# Altium schematic sheet STM32F103RCT6_V2.1.schdoc
size 279 x 241 mm
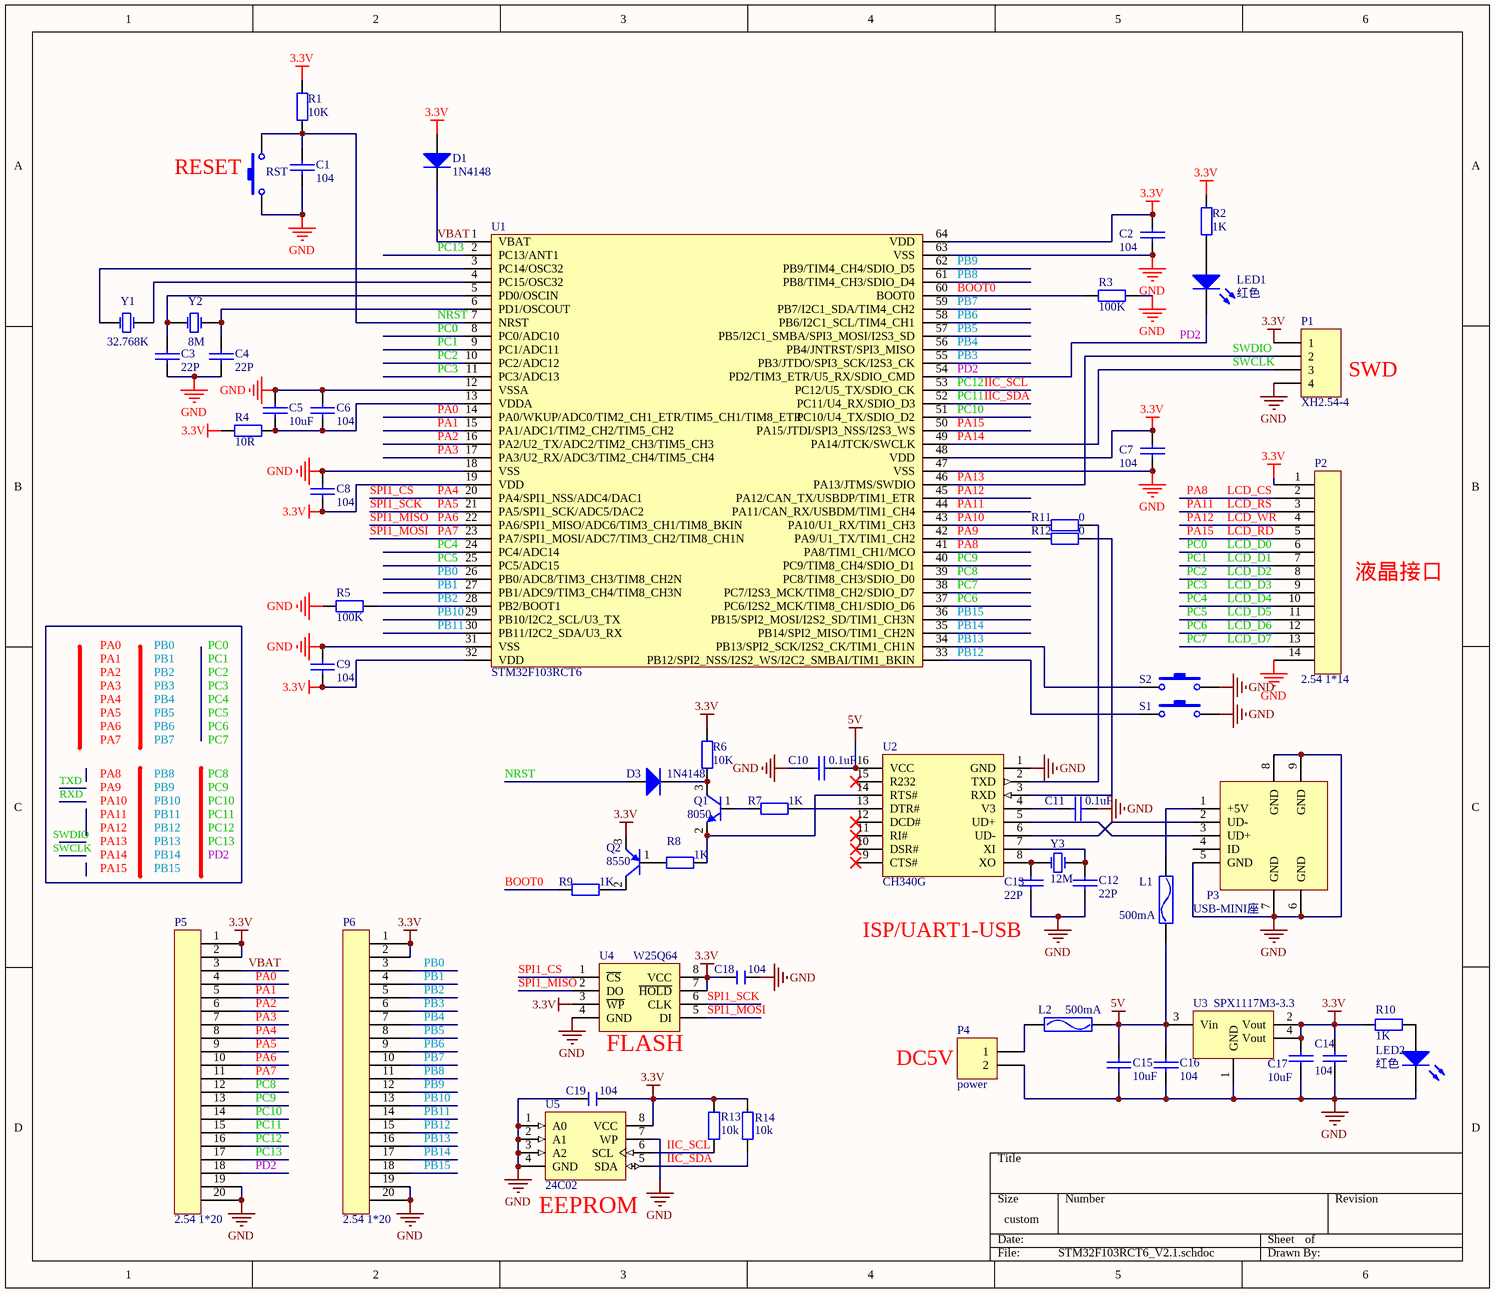
[diagram p0: STM32F103RCT6_V2.1.schdoc]

## Parts
C1  104  [0805]
C2  104  [0805]
C3  22P  [0805]
C4  22P  [0805]
C5  10uF  [1206]
C6  104  [0805]
C7  104  [0805]
C8  104  [0805]
C9  104  [0805]
C10  0.1uF  [0805]
C11  0.1uF  [0805]
C12  22P  [0805]
C13  22P  [0805]
C14  104  [0805]
C15  10uF  [1206]
C16  104  [0805]
C17  10uF  [1206]
C18  104  [0805]
C19  104  [0805]
D1  1N4148  [二极管 贴片 IN4148]
D3  1N4148  [二极管 贴片 IN4148]
L1  500mA  [0805]
L2  500mA  [0805]
LED1  红色  [LED0805]
LED2  红色  [LED0805]
P1  XH2.54-4  [VH2.54_4]
P2  2.54 1*14  [单排插针 2.54 1*14]
P3  USB-MINI座  [USB MINI DIP]
P4  power  [VH2.54_2]
P5  2.54 1*20  [单排插针 2.54 1*20]
P6  2.54 1*20  [单排插针 2.54 1*20]
Q1  8050  [sot23b]
Q2  8550  [sot23b]
R1  10K  [0805]
R2  1K  [0805]
R3  100K  [0805]
R4  10R  [0805]
R5  100K  [0805]
R6  10K  [0805]
R7  1K  [0805]
R8  1K  [0805]
R9  1K  [0805]
R10  1K  [0805]
R11  0  [0805]
R12  0  [0805]
R13  10k  [0805]
R14  10k  [0805]
RST  key  [按键 轻触  6*3]  (value not drawn)
S1  key  [按键 轻触  6*3]  (value not drawn)
S2  key  [按键 轻触  6*3]  (value not drawn)
U1  STM32F103RCT6  [LQFP64]
U2  CH340G  [SOIC16]
U3  SPX1117M3-3.3  [SOT223]
U4  W25Q64  [SO8-W]
U5  24C02  [SOIC8]
Y1  32.768K  [晶振 卧 BCY-W2/D3.1]
Y2  8M  [晶振 BCY-W2/E4.7]
Y3  12M  [晶振 BCY-W2/E4.7]

## Nets
3.3V: C2.1 C7.1 C8.1 C9.1 C14.1 C17.1 C18.2 C19.1 D1.1(A) P1.1 P2.1 P5.1 P5.2 P6.1 P6.2 Q2.3(E) R1.1 R2.1 R4.1 R6.2 R10.2 R13.1 R14.1 U1.19(VDD) U1.32(VDD) U1.48(VDD) U1.64(VDD) U3.2(Vout) U3.4(Vout) U4.3(~{WP}) U4.7(~{HOLD}) U4.8(VCC) U5.8(VCC)
5V: C10.1 C15.1 C16.1 L1.1 L2.1 U2.16(VCC) U3.3(Vin)
GND: C1.1 C2.2 C3.1 C4.1 C5.2 C6.2 C7.2 C8.2 C9.2 C10.2 C11.1 C12.1 C13.1 C14.2 C15.2 C16.2 C17.2 C18.1 C19.2 LED2.2(K) P1.4 P2.14 P3.5(GND) P3.6(GND) P3.7(GND) P3.8(GND) P3.9(GND) P4.2 P5.19 P5.20 P6.19 P6.20 R3.1 R5.1 RST.1 S1.1 S2.1 U1.12(VSSA) U1.18(VSS) U1.31(VSS) U1.47(VSS) U1.63(VSS) U2.1(GND) U3.1(GND) U4.4(GND) U5.1(A0) U5.2(A1) U5.3(A2) U5.4(GND) U5.7(WP)
BOOT0: R3.2 R9.1 U1.60(BOOT0)
IIC_SCL: P5.16 R13.2 U1.53(PC12/U5_TX/SDIO_CK) U5.6(SCL)  [also labelled PC12]
IIC_SDA: P5.15 R14.2 U1.52(PC11/U4_RX/SDIO_D3) U5.5(SDA)  [also labelled PC11]
LCD_CS: P2.2 U1.41(PA8/TIM1_CH1/MCO)  [also labelled PA8]
LCD_D0: P2.6 U1.8(PC0/ADC10)  [also labelled PC0]
LCD_D1: P2.7 U1.9(PC1/ADC11)  [also labelled PC1]
LCD_D2: P2.8 U1.10(PC2/ADC12)  [also labelled PC2]
LCD_D3: P2.9 U1.11(PC3/ADC13)  [also labelled PC3]
LCD_D4: P2.10 U1.24(PC4/ADC14)  [also labelled PC4]
LCD_D5: P2.11 U1.25(PC5/ADC15)  [also labelled PC5]
LCD_D6: P2.12 U1.37(PC6/I2S2_MCK/TIM8_CH1/SDIO_D6)  [also labelled PC6]
LCD_D7: P2.13 U1.38(PC7/I2S3_MCK/TIM8_CH2/SDIO_D7)  [also labelled PC7]
LCD_RD: P2.5 U1.50(PA15/JTDI/SPI3_NSS/I2S3_WS)  [also labelled PA15]
LCD_RS: P2.3 U1.44(PA11/CAN_RX/USBDM/TIM1_CH4)  [also labelled PA11]
LCD_WR: P2.4 U1.45(PA12/CAN_TX/USBDP/TIM1_ETR)  [also labelled PA12]
NRST: C1.2 D3.1(A) R1.2 RST.2 U1.7(NRST)
PA0: P5.4 U1.14(PA0/WKUP/ADC0/TIM2_CH1_ETR/TIM5_CH1/TIM8_ETR)
PA1: P5.5 U1.15(PA1/ADC1/TIM2_CH2/TIM5_CH2)
PA2: P5.6 U1.16(PA2/U2_TX/ADC2/TIM2_CH3/TIM5_CH3)
PA3: P5.7 U1.17(PA3/U2_RX/ADC3/TIM2_CH4/TIM5_CH4)
PA4: P5.8 U1.20(PA4/SPI1_NSS/ADC4/DAC1) U4.1(~{CS})  [also labelled SPI1_CS]
PA5: P5.9 U1.21(PA5/SPI1_SCK/ADC5/DAC2) U4.6(CLK)  [also labelled SPI1_SCK]
PA6: P5.10 U1.22(PA6/SPI1_MISO/ADC6/TIM3_CH1/TIM8_BKIN) U4.2(DO)  [also labelled SPI1_MISO]
PA7: P5.11 U1.23(PA7/SPI1_MOSI/ADC7/TIM3_CH2/TIM8_CH1N) U4.5(DI)  [also labelled SPI1_MOSI]
PA9: R12.2 U1.42(PA9/U1_TX/TIM1_CH2)
PA10: R11.2 U1.43(PA10/U1_RX/TIM1_CH3)
PA13: P1.2 U1.46(PA13/JTMS/SWDIO)  [also labelled SWDIO]
PA14: P1.3 U1.49(PA14/JTCK/SWCLK)  [also labelled SWCLK]
PB0: P6.3 U1.26(PB0/ADC8/TIM3_CH3/TIM8_CH2N)
PB1: P6.4 U1.27(PB1/ADC9/TIM3_CH4/TIM8_CH3N)
PB2: P6.5 R5.2 U1.28(PB2/BOOT1)
PB3: P6.6 U1.55(PB3/JTDO/SPI3_SCK/I2S3_CK)
PB4: P6.7 U1.56(PB4/JNTRST/SPI3_MISO)
PB5: P6.8 U1.57(PB5/I2C1_SMBA/SPI3_MOSI/I2S3_SD)
PB6: P6.9 U1.58(PB6/I2C1_SCL/TIM4_CH1)
PB7: P6.10 U1.59(PB7/I2C1_SDA/TIM4_CH2)
PB8: P6.11 U1.61(PB8/TIM4_CH3/SDIO_D4)
PB9: P6.12 U1.62(PB9/TIM4_CH4/SDIO_D5)
PB10: P6.13 U1.29(PB10/I2C2_SCL/U3_TX)
PB11: P6.14 U1.30(PB11/I2C2_SDA/U3_RX)
PB12: P6.15 S1.2 U1.33(PB12/SPI2_NSS/I2S2_WS/I2C2_SMBAI/TIM1_BKIN)
PB13: P6.16 S2.2 U1.34(PB13/SPI2_SCK/I2S2_CK/TIM1_CH1N)
PB14: P6.17 U1.35(PB14/SPI2_MISO/TIM1_CH2N)
PB15: P6.18 U1.36(PB15/SPI2_MOSI/I2S2_SD/TIM1_CH3N)
PC8: P5.12 U1.39(PC8/TIM8_CH3/SDIO_D0)
PC9: P5.13 U1.40(PC9/TIM8_CH4/SDIO_D1)
PC10: P5.14 U1.51(PC10/U4_TX/SDIO_D2)
PC13: P5.17 U1.2(PC13/ANT1)
PD2: LED1.2(K) P5.18 U1.54(PD2/TIM3_ETR/U5_RX/SDIO_CMD)
VBAT: D1.2(K) P5.3 U1.1(VBAT)
NetC3_2: C3.2 U1.5(PD0/OSCIN) Y2.2(OSC2)
NetC4_2: C4.2 U1.6(PD1/OSCOUT) Y2.1(OSC1)
NetC5_1: C5.1 C6.1 R4.2 U1.13(VDDA)
NetC11_2: C11.2 U2.4(V3)
NetC12_2: C12.2 U2.7(XI) Y3.1(OSC1)
NetC13_2: C13.2 U2.8(XO) Y3.2(OSC2)
NetD3_2: D3.2(K) Q1.3(C) R6.1
NetL1_2: L1.2 P3.1(+5V)
NetL2_2: L2.2 P4.1
NetLED1_1: LED1.1(A) R2.2
NetLED2_1: LED2.1(A) R10.1
NetP3_2: P3.2(UD-) U2.6(UD-)
NetP3_3: P3.3(UD+) U2.5(UD+)
NetQ1_1: Q1.1(B) R7.1
NetQ1_2: Q1.2(E) R8.2 U2.14(RTS#)
NetQ2_1: Q2.1(B) R8.1
NetQ2_2: Q2.2(C) R9.2
NetR7_2: R7.2 U2.13(DTR#)
NetR11_1: R11.1 U2.2(TXD)
NetR12_1: R12.1 U2.3(RXD)
NetU1_3: U1.3(PC14/OSC32) Y1.1(OSC1)
NetU1_4: U1.4(PC15/OSC32) Y1.2(OSC2)

Not connected (* = marked no-connect by the designer): P3 4(ID); U2 9(CTS#)* 10(DSR#)* 11(RI#)* 12(DCD#)* 15(R232)*

## Notes on the sheet
- (near RST) RESET
- (near P1) SWD
- (near P2) 液晶接口
- SWDIO
- TXD
- RXD
- SWCLK
- ISP/UART1-USB
- (near U4) FLASH
- DC5V
- (near U5) EEPROM
- Labels drawn without touching a wire or pin: PA0, PA1, PA2, PA3, PA4, PA5, PA6, PA7, PA8, PA9, PA10, PA11, PA12, PA13, PA14, PA15, PB0, PB1, PB2, PB3, PB4, PB5, PB6, PB7, PB8, PB9, PB10, PB11, PB12, PB13, PB14, PB15, PC0, PC1, PC2, PC3, PC4, PC5, PC6, PC7, PC8, PC9, PC10, PC11, PC12, PC13, PD2

## Library data of the parts
C1-C13 = 贴片电容 0805: 名称: 贴片电容; 封装: 0603; 单位: 个
C14 C16 = 贴片电容 0805: 名称: 贴片电容; 单位: 个; 封装: 0805
C15 C17 = 贴片电容 0805: 名称: 贴片电容; 封装: 0805; 单位: 个
C18 C19 = C: 无极性贴片电容; 版权归属: 源创客; 材质: X7R; BOM名称: 无极性贴片电容; 学习资源: www.ooocke.com
D1 D3 = 二极管 贴片 1N4148: 名称: 贴片二极管; 封装: 1206; 单位: 个
L1 L2 = 保险_自恢复: 单位: 个; 名称: 自恢复保险管; 封装: 0805
LED1 LED2 = 发光二极管 Φ3: D_RED_D; 名称: 发光二极管; 封装: Φ3; 单位: 个
P1 = 联结件 XH2.54-4: 名称: 联结件; 单位: 套; 封装: XH2.54-4
P2 = 联结件 单排插针 2.54 1*14: 单位: 片; 封装: DIP; 名称: 单排插针
P3 = 联结件 USB-MINI座: 单位: 个; 封装: 440068; 名称: 联结件
P4 = 联结件 电源插头座: 名称: 联结件; 封装: 电源插头座; 单位: 套
P5 P6 = 联结件 单排插针 2.54 1*20: 单位: 条; 封装: DIP; 名称: 单排插针
Q1 = 三极管 贴片 NPN: NPN 8050; 名称: 贴片三极管; 单位: 个; 封装: SOT23B
Q2 = 三极管 贴片PNP: PNP 8550; 名称: 贴片三极管; 单位: 个; 封装: SOT23B
R1 R4 R6-R9 = 贴片电阻 0603: 名称: 贴片电阻; 封装: 0603; 单位: 个
R2 R3 R5 R10-R12 = 贴片电阻 0805: 名称: 贴片电阻; 单位: 个; 封装: 0805
R13 R14 = R: 贴片电阻; 版权归属: 源创客; BOM名称: 贴片电阻; 学习资源: www.ooocke.com
RST S1 S2 = 按键 轻触 3*6: 单位: 个; 名称: 开关; 封装: 直插 12*12*12
U1 = 贴片芯片 STM32F103RCT6: 名称: 芯片; 单位: 片; 封装: LQFP64
U2 = 贴片芯片 CH340G: 单位: 片; 名称: 贴片芯片; 封装: SOIC16
U3 = 贴片芯片 SPX1117M3-5.0: 名称: 贴片芯片; 单位: 个; 封装: SOT223
U4 = W25Qxx: 外置Flash; 版权归属: 源创客; BOM名称: 外置Flash; 学习资源: www.ooocke.com
U5 = 24Cxx: 外置EEPROM; 版权归属: 源创客; BOM名称: 外置EEPROM; 学习资源: www.ooocke.com
Y1-Y3 = 晶振 直插矮: 名称: 晶振; 封装: 直插矮; 单位: 个